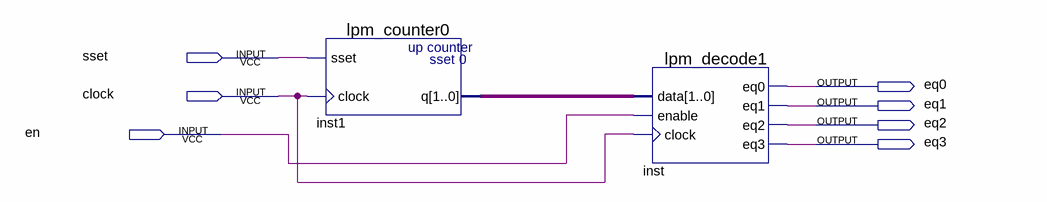
[diagram p0: schematic sheet]
// Quartus schematic sequence_timer.bdf as structural Verilog: 2 symbols, 7 pins
module sequence_timer (
  input  sset,
  input  clock,
  input  en,
  output eq0,
  output eq1,
  output eq2,
  output eq3
);

  wire [1:0] inst1_q;

  lpm_counter0 inst1 (.sset(sset), .clock(clock), .q(inst1_q));
  lpm_decode1 inst (.data(inst1_q), .enable(en), .clock(clock), .eq0(eq0), .eq1(eq1), .eq2(eq2), .eq3(eq3));
endmodule
